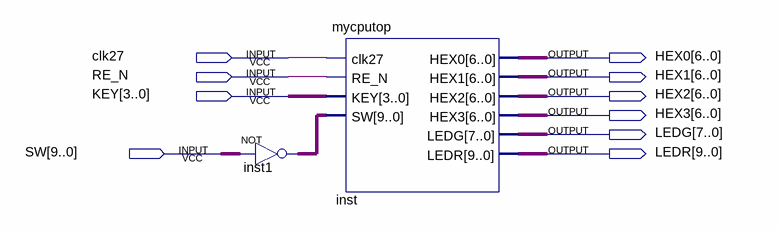
[diagram p0: schematic sheet]
// Quartus schematic dpj.bdf as structural Verilog: 2 symbols, 10 pins
module dpj (
  input  clk27,
  input  RE_N,
  input  [3:0] KEY,
  input  [9:0] SW,
  output [6:0] HEX0,
  output [6:0] HEX1,
  output [6:0] HEX2,
  output [6:0] HEX3,
  output [7:0] LEDG,
  output [9:0] LEDR
);

  wire [9:0] inst1_out;

  assign inst1_out = ~SW;  // NOT inst1, 10 bits wide
  mycputop inst (
    .clk27(clk27), .RE_N(RE_N), .KEY(KEY), .SW(inst1_out), .HEX0(HEX0), .HEX1(HEX1), .HEX2(HEX2),
    .HEX3(HEX3), .LEDG(LEDG), .LEDR(LEDR));
endmodule
